# Altium schematic sheet 05.SchDoc
size 386 x 246 mm
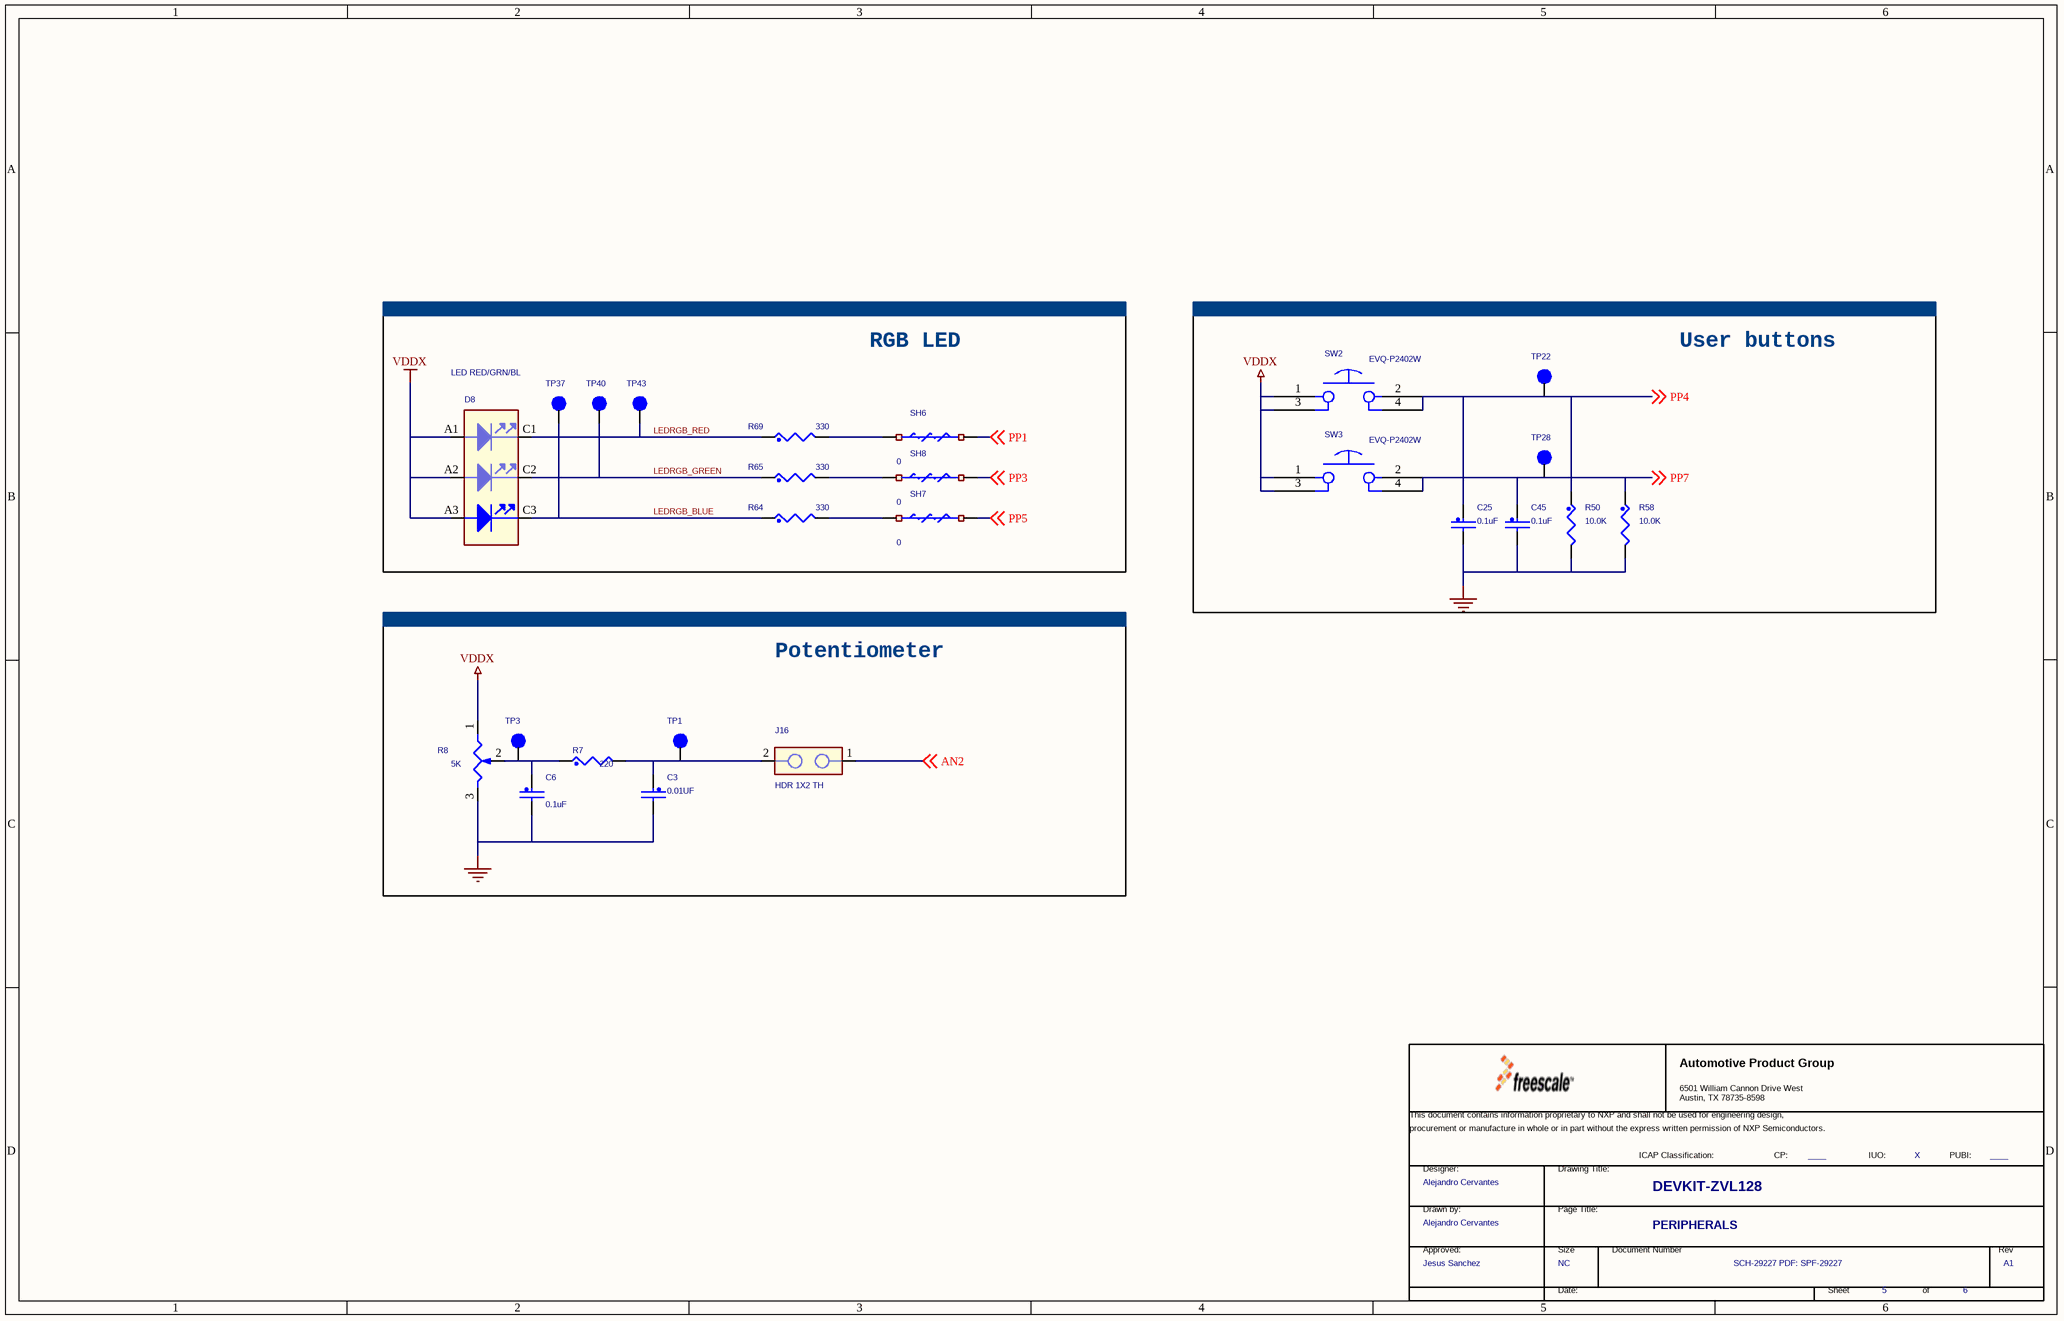
[diagram p0: 05.SchDoc]

## Parts
*  FCP: ____  FIUO: X  DrawnBy: Alejandro Cervantes  Approver: Jesus Sanchez  PageTitle: PERIPHERALS  Page Count: 6  Page Number: 5  Page Size: NC  Title: DEVKIT-ZVL128  RevCode: A1  Doc: SCH-29227 PDF: SPF-29227  (hidden comment: TitleBlock_AMPG)  (graphical)
C3  0.01UF  [CC0402_25]
C6  0.1uF  [CC0402_25]
C25  0.1uF  [CC0402_25]
C45  0.1uF  [CC0402_25]
D8  LED RED/GRN/BL  [led6_5x6mm]
J16  HDR 1X2 TH  [HDR102]
R7  220  [RC0603_OV]
R8  5K  [pot3_3352t]
R50  10.0K  [RC0402_25]
R58  10.0K  [RC0402_25]
R64  330  [RC0603_OV]
R65  330  [RC0603_OV]
R69  330  [RC0603_OV]
SH6  0  [SH0603]
SH7  0  [SH0603]
SH8  0  [SH0603]
SW2  EVQ-P2402W  [sw4_spst_4p8X3p6_2p5]
SW3  EVQ-P2402W  [sw4_spst_4p8X3p6_2p5]
TP1  TPAD_028  [TPAD_028]  (value not drawn)
TP3  TPAD_028  [TPAD_028]  (value not drawn)
TP22  TPAD_028  [TPAD_028]  (value not drawn)
TP28  TPAD_028  [TPAD_028]  (value not drawn)
TP37  TPAD_028  [TPAD_028]  (value not drawn)
TP40  TPAD_028  [TPAD_028]  (value not drawn)
TP43  TPAD_028  [TPAD_028]  (value not drawn)

## Blocks framed on the sheet
User buttons: C25 C45 R50 R58 SW2 SW3 TP22 TP28
RGB LED: D8 R64 R65 R69 SH6-SH8 TP37 TP40 TP43
Potentiometer: C3 C6 J16 R7 R8 TP1 TP3

## Nets
GND: C3.2 C6.2 C25.2 C45.2 R8.3(B) R50.2 R58.2
VDDX: D8.A1(ANODE1) D8.A2(ANODE2) D8.A3(ANODE3) R8.1(A) SW2.1 SW2.3 SW3.1 SW3.3
AN2: J16.1 ; off-sheet AN2
LEDRGB_BLUE: D8.C3(CATHODE3) R64.1 TP37.1(Pin1)
LEDRGB_GREEN: D8.C2(CATHODE2) R65.1 TP40.1(Pin1)
LEDRGB_RED: D8.C1(CATHODE1) R69.1 TP43.1(Pin1)
PP1: SH6.2 ; off-sheet PP1
PP3: SH8.2 ; off-sheet PP3
PP4: C25.1 R50.1 SW2.2 SW2.4 TP22.1(Pin1) ; off-sheet PP4
PP5: SH7.2 ; off-sheet PP5
PP7: C45.1 R58.1 SW3.2 SW3.4 TP28.1(Pin1) ; off-sheet PP7
NetC3_1: C3.1 J16.2 R7.2 TP1.1(Pin1)
NetC6_1: C6.1 R7.1 R8.2(WIPER) TP3.1(Pin1)
NetR64_2: R64.2 SH7.1
NetR65_2: R65.2 SH8.1
NetR69_2: R69.2 SH6.1

## Notes on the sheet
- (in symbol TitleBlock_AMPG) Automotive Product Group; 6501 William Cannon Drive West / Austin, TX 78735-8598; This document contains information proprietary to NXP and shall not be used for engineering design,; procurement or manufacture in whole or in part without the express written permission of NXP Semiconductors.; ICAP Classification:; CP:; IUO:; PUBI:; Designer:; Drawing Title:; Drawn by:; Page Title:; Approved:; Size; Document Number; Rev; Date:; Sheet; of

## Library data of the parts
* = TitleBlock_AMPG: OrgName: Freescale Semiconductor; OrgAddr1: 6501 William Cannon Drive West; OrgAddr2: Austin, TX 78735-8598; PUBI: ____; Designer: Alejandro Cervantes; Page Create Date: March  8, 1995
C3 = CAP_NP: CAP CER 0.01UF 16V 20% X7R 0402; CLASS: DISCRETE; AGILE_PN: 150-30082; MFG_NAME01: AVX; MFG_PN01: 0402YC103MAT2A; CAD_APPROVED: Yes; FPLIST: CC0402_25,CC0402_HD,0402_CC; TOL: 20%; ROHS: Yes; HEIGHT: 0.56MM; Tolerance: 20%; VOLTAGE: 16V
C6 = CAP_NP: CAP CER 0.1uF 50V 10% X7R 0402; CLASS: DISCRETE; SIGNAL_MODEL: DEFAULT_CAPACITOR_100000pF_2_1; FPLIST: CC0402_25,CC0402_HD,0402_CC; CAD_APPROVED: Yes; MFG_PN01: GRM155R71H104KE14D; MFG_NAME01: MURATA; AGILE_PN: 150-79069; VOLTAGE: 50V; TOL: 10%; HEIGHT: 0.55MM; ROHS: Yes; Tolerance: 10%
C25 C45 = CAP_NP: CAP CER 0.1uF 50V 10% X7R 0402; CLASS: DISCRETE; FPLIST: CC0402_25,CC0402_HD,0402_CC; CAD_APPROVED: Yes; MFG_PN01: GRM155R71H104KE14D; MFG_NAME01: MURATA; AGILE_PN: 150-79069; PRIORITY_PN: 021-00169; SIGNAL_MODEL: DEFAULT_CAPACITOR_100000pF_2_1; HEIGHT: 0.55MM; ROHS: Yes; Tolerance: 10%; VOLTAGE: 50V
D8 = LED_TRI_COLOR: LED RED/GRN/BL SGL 3-IN-1 50mA SMT; CLASS: IC; CAD_APPROVED: Yes; MFG_PN01: CLP6C-FKB-CM1Q1H1BB7R3R3; MFG_NAME01: Cree, Inc; AGILE_PN: 370-76661; HEIGHT: 2.6 MM; ROHS: Yes
J16 = JUMPER_2_2mm: HDR 1X2 TH 100MIL SP 339H AU 98L; CLASS: IO; AGILE_PN: 210-80468; MFG_NAME01: SAMTEC; MFG_PN01: TSW-102-07-G-S; CAD_APPROVED: YES; FPLIST: HDR102,SH_HDR102_BOTTOM; ROHS: Yes; HEIGHT: 8.71 MM
R7 = RES: RES MF 220 OHM 1/10W 5% 0603; CLASS: DISCRETE; AGILE_PN: 470-30297; MFG_NAME01: KOA SPEER; MFG_PN01: RK73B1JTTD221J; CAD_APPROVED: Yes; FPLIST: RC0603_OV,RC0603,0603_CC; HEIGHT: 0.6MM; Tolerance: 5%; ROHS: Yes
R8 = POT: RES POT 5K 1/2W 20% TH; CLASS: DISCRETE; AGILE_PN: 470-80115; MFG_NAME01: BOURNS; MFG_PN01: 3352T-1-502LF; CAD_APPROVED: Yes; HEIGHT: 4.32 MM; TOL: 20%; Tolerance: 20%; ROHS: Yes
R50 R58 = RES: RES MF 10.0K 1/16W 1% AEC-Q200 0402; CLASS: DISCRETE; PRIORITY_PN: 006-00552; AGILE_PN: 470-75416; MFG_NAME01: KOA SPEER; MFG_PN01: RK73H1ETTP1002F; CAD_APPROVED: Yes; FPLIST: RC0402_25,RC0402_HD,0402_CC; SIGNAL_MODEL: DEFAULT_RESISTOR_10000OHM_2_1; Tolerance: 1%; ROHS: Yes; TOL: 1%; HEIGHT: 0.4MM
R64 R65 R69 = RES: RES MF 330 OHM 1/10W 5% 0603; CLASS: DISCRETE; AGILE_PN: 470-80926; MFG_NAME01: YAGEO AMERICA; MFG_PN01: RC0603JR-07330RL; CAD_APPROVED: Yes; FPLIST: RC0603_OV,RC0603,0603_CC; Tolerance: 5%; ROHS: Yes; HEIGHT: 0.55 MM
SH6 SH8 = RES_SHORT-2: ZERO OHM CUT TRACE 0603 PADS; NO PART TO ORDER; CLASS: DISCRETE; AGILE_PN: 470-80018; MFG_NAME01: LAYOUT ELEMENT ONLY; CAD_APPROVED: Yes; FPLIST: SH0603,SH0603_CC,SH0603-X2_PIN1TO2; MFG_PN01: LAYOUT ELEMENT ONLY; ROHS: Yes; HEIGHT: 0.1MM
SH7 = RES_SHORT-2: ZERO OHM CUT TRACE 0603 PADS; NO PART TO ORDER; CLASS: DISCRETE; FPLIST: SH0603,SH0603_CC,SH0603-X2_PIN1TO2; CAD_APPROVED: Yes; MFG_PN01: LAYOUT ELEMENT ONLY; AGILE_PN: 470-80018; HEIGHT: 0.1MM; ROHS: Yes; MFG_NAME01: LAYOUT ELEMENT ONLY
SW2 = EDGE_MOUNT_PB_SW_2: SW SPST PB NO 0.02A 15V SMT; CLASS: IC; CAD_APPROVED: Yes; MFG_NAME01: Panasonic; AGILE_PN: 510-77992; HEIGHT: 2.7 MM; ROHS: Yes; MFG_PN01: EVQ-P2402W
SW3 = EDGE_MOUNT_PB_SW_2: SW SPST PB NO 0.02A 15V SMT; CLASS: IC; AGILE_PN: 510-77992; MFG_NAME01: Panasonic; CAD_APPROVED: Yes; MFG_PN01: EVQ-P2402W; ROHS: Yes; HEIGHT: 2.7 MM
TP1 TP3 TP43 = TestLoop: TEST POINT PAD 28MIL DIA SMT, NO PART TO ORDER; CLASS: IO; CAD_APPROVED: Yes; AGILE_PN: 211-79313; HEIGHT: 0.1 MM; ROHS: Yes; MFG_PN01: N/A; MFG_NAME01: N/A
TP22 TP28 TP37 TP40 = TestLoop: TEST POINT PAD 28MIL DIA SMT, NO PART TO ORDER; CLASS: IO; AGILE_PN: 211-79313; CAD_APPROVED: Yes; MFG_NAME01: N/A; MFG_PN01: N/A; ROHS: Yes; HEIGHT: 0.1 MM